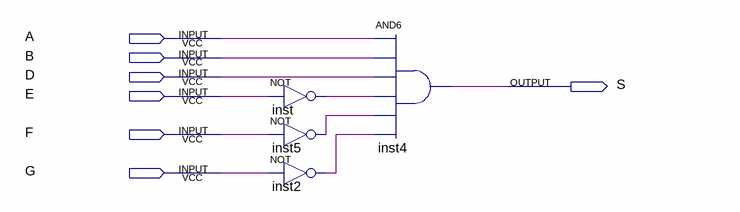
[diagram p0: schematic sheet]
// Quartus schematic Block5.bdf as structural Verilog: 4 symbols, 7 pins
module Block5 (
  input  A,
  input  B,
  input  D,
  input  E,
  input  F,
  input  G,
  output S
);

  wire inst2_out, inst5_out, inst_out;

  not inst (inst_out, E);
  not inst5 (inst5_out, F);
  not inst2 (inst2_out, G);
  and inst4 (S, A, B, D, inst_out, inst5_out, inst2_out);
endmodule
